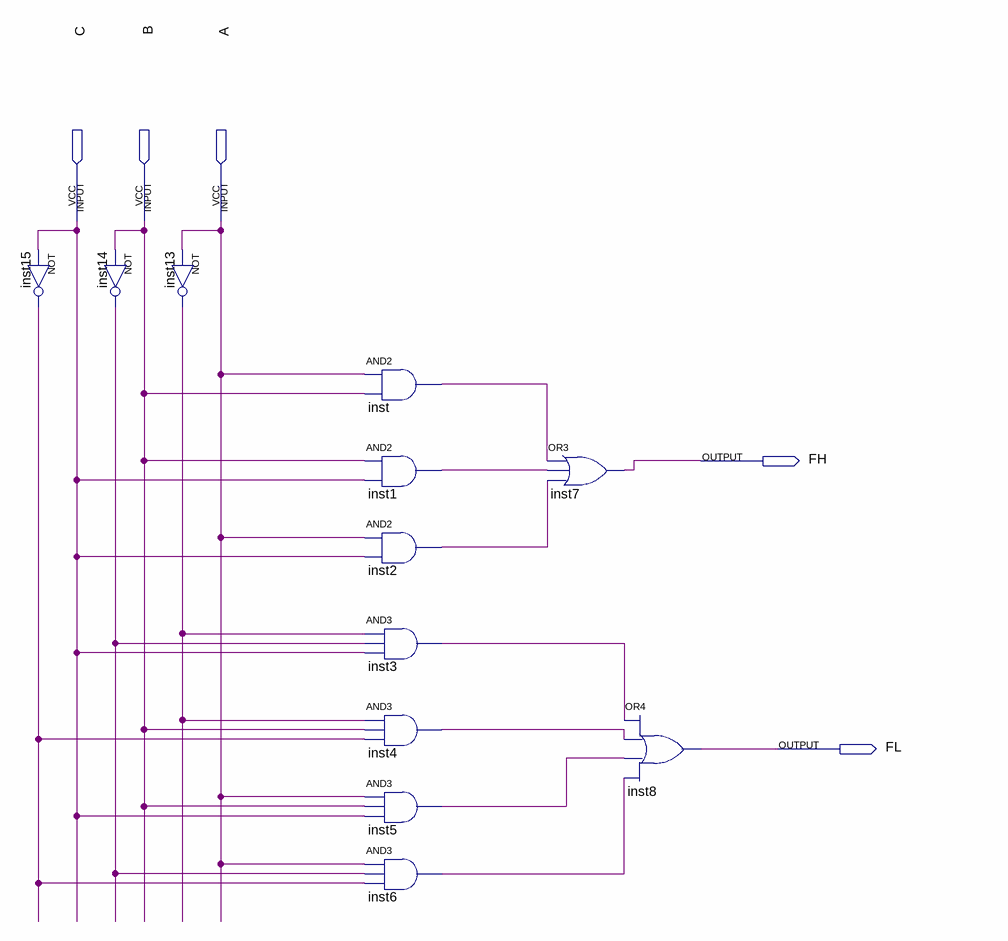
[diagram p0: schematic sheet]
// Quartus schematic testschema.bdf as structural Verilog: 12 symbols, 5 pins
module testschema (
  input  C,
  input  B,
  input  A,
  output FH,
  output FL
);

  wire inst1_out, inst2_out, inst3_out, inst4_out, inst5_out, inst6_out, inst13_out, inst14_out, inst15_out,
       inst_out;

  not inst15 (inst15_out, C);
  not inst14 (inst14_out, B);
  not inst13 (inst13_out, A);
  and inst (inst_out, A, B);
  and inst1 (inst1_out, B, C);
  and inst2 (inst2_out, A, C);
  and inst3 (inst3_out, inst13_out, inst14_out, C);
  and inst4 (inst4_out, inst13_out, B, inst15_out);
  and inst5 (inst5_out, A, B, C);
  and inst6 (inst6_out, A, inst14_out, inst15_out);
  or inst7 (FH, inst_out, inst1_out, inst2_out);
  or inst8 (FL, inst3_out, inst4_out, inst5_out, inst6_out);
endmodule
